# Altium project D_class_amplifier.PrjPcb
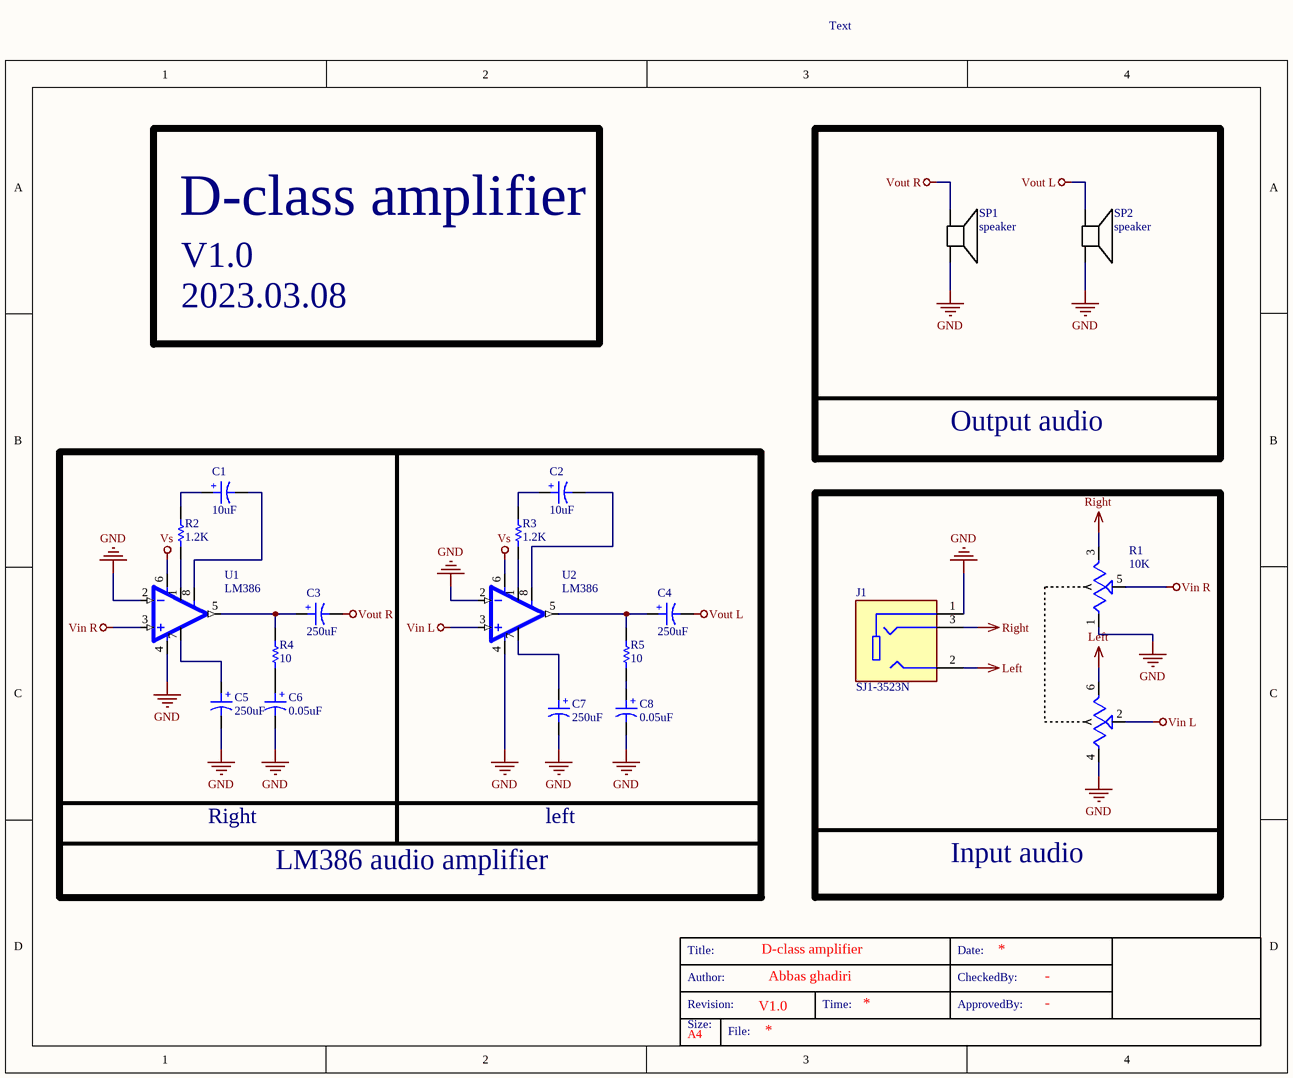
[diagram p0: D_class_amplifier_schematic.SchDoc]
1 sheet, 18 parts. Net scope: global (net labels, ports and power ports of the same name join across sheets).
Board file: D_class_amplifier_PCB.PcbDoc

## Sheet D_class_amplifier_schematic.SchDoc: D-class amplifier
size A; ApprovedBy: -; CheckedBy: -; Author: Abbas ghadiri; Revision: V1.0; SheetNumber: 1; SheetTotal: 1

### Parts
C1  10uF  [capacity]
C2  10uF  [capacity]
C3  250uF  [capacity]
C4  250uF  [capacity]
C5  250uF  [capacity]
C6  0.05uF  [capacity]
C7  250uF  [capacity]
C8  0.05uF  [capacity]
J1  SJ1-3523N  [SJ1-3523N]
R1  10K  [PTV112-4]
R2  1.2K  [resistor 1206]
R3  1.2K  [resistor 1206]
R4  10  [resistor 1206]
R5  10  [resistor 1206]
SP1  speaker  [speaker]
SP2  speaker  [speaker]
U1  LM386  [LM386]
U2  LM386  [LM386]

### Blocks framed on the sheet
Output audio: SP1 SP2
LM386 audio amplifier: C1-C8 R2-R5 U1 U2
Input audio: J1 R1

### Nets
GND: C5.2 C6.2 C7.2 C8.2 J1.1 R1.1 R1.4 SP1.2(NEG) SP2.2(NEG) U1.2(-IN) U1.4(V-) U2.2(-IN) U2.4(V-)
Left: J1.2 R1.6
Right: J1.3 R1.3
Vin L: R1.2 U2.3(+IN)
Vin R: R1.5 U1.3(+IN)
Vout L: C4.2 SP2.1(POS)
Vout R: C3.2 SP1.1(POS)
Vs: U1.6(V+) U2.6(V+)
NetC1_1: C1.1 R2.2
NetC1_2: C1.2 U1.8(GAIN@8)
NetC2_1: C2.1 R3.2
NetC2_2: C2.2 U2.8(GAIN@8)
NetC3_1: C3.1 R4.2 U1.5(OUT)
NetC4_1: C4.1 R5.2 U2.5(OUT)
NetC5_1: C5.1 U1.7(BP)
NetC6_1: C6.1 R4.1
NetC7_1: C7.1 U2.7(BP)
NetC8_1: C8.1 R5.1
NetR2_1: R2.1 U1.1(GAIN@1)
NetR3_1: R3.1 U2.1(GAIN@1)

### Notes on the sheet
- Text
- D-class amplifier
- V1.0
- 2023.03.08
- Right
- left
- A4
- Title:
- Date:
- Size:
- Author:
- Revision:
- Time:
- CheckedBy:
- ApprovedBy:
- File:
- (in symbol Cap electrolitic radial 6x7-2.5) +

### Library data of the parts
C1-C8 = Cap electrolitic radial 6x7-2.5
R1 = PTV112-4
R2-R5 = Resistor 1206